# EasyEDA schematic seedrum_shield_v1.json

## Sheets
1 Main Shield: TITLE: Seedup Processors; REV: 1.0; Date: 2020-10-29; Sheet: 1/1; Drawn By: victor.halla; Company: Seedup
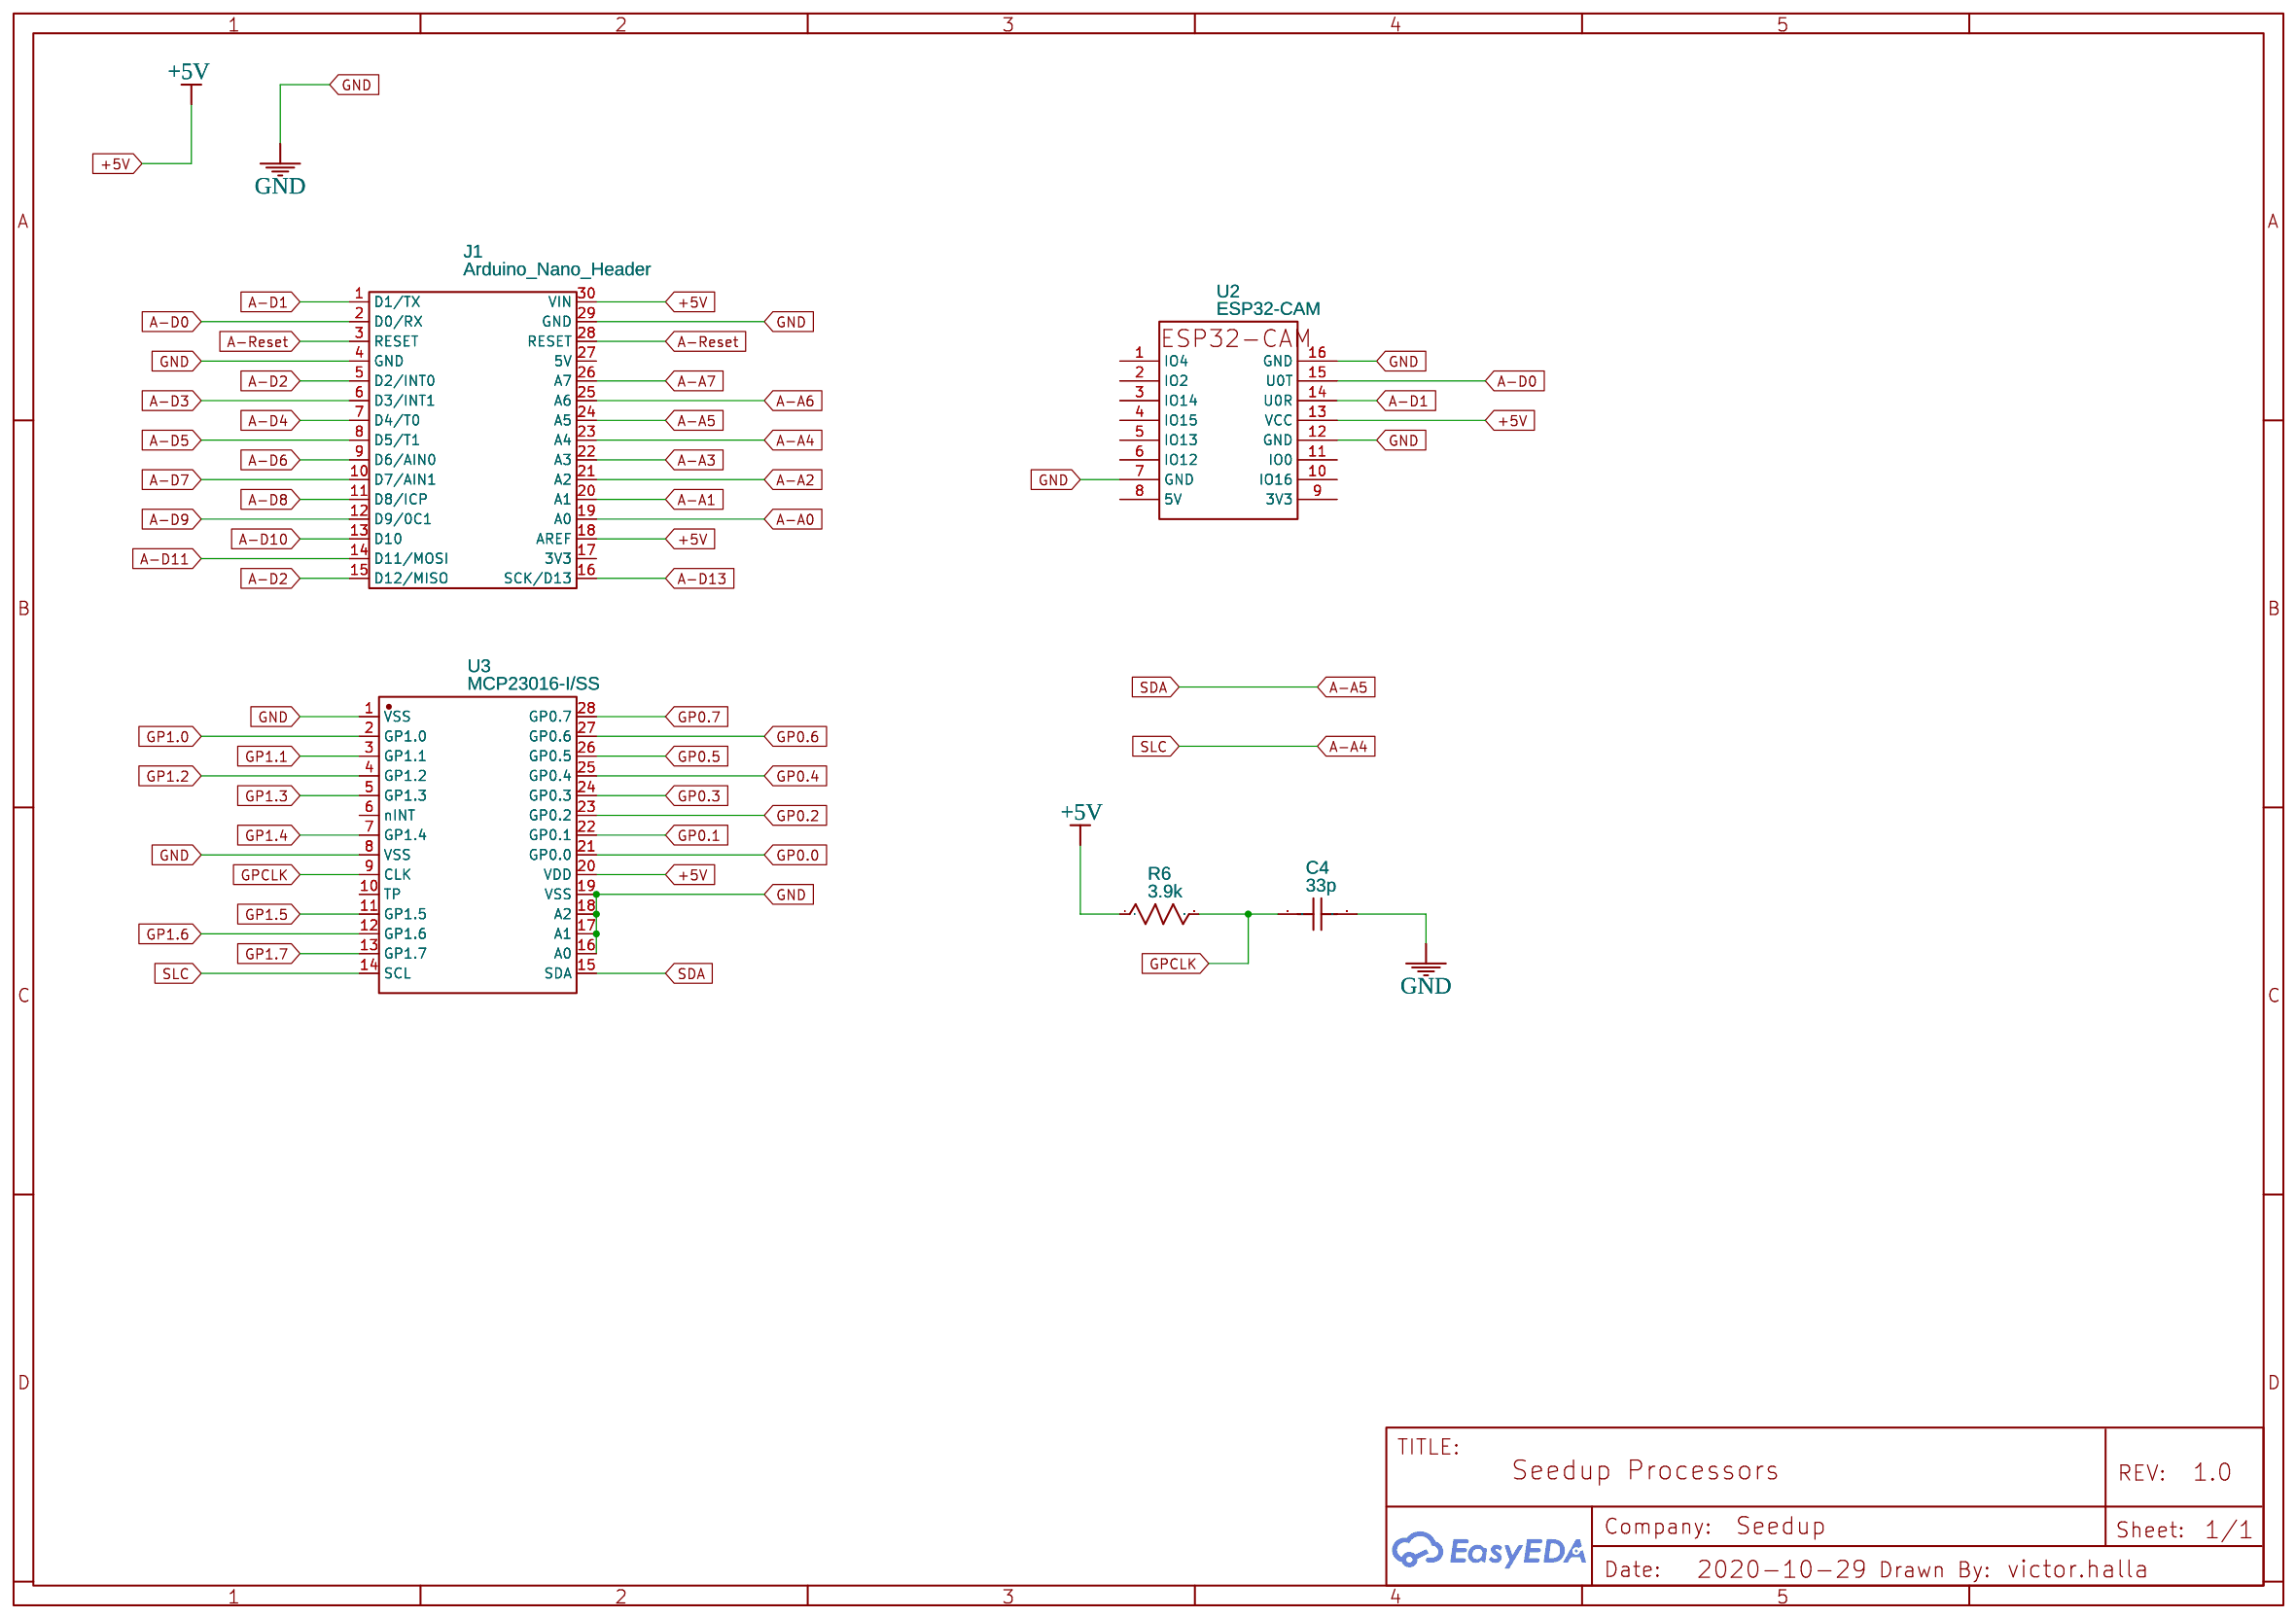
[diagram p0: Main Shield]
2 Power: TITLE: Seedup Power; Date: 2020-10-30
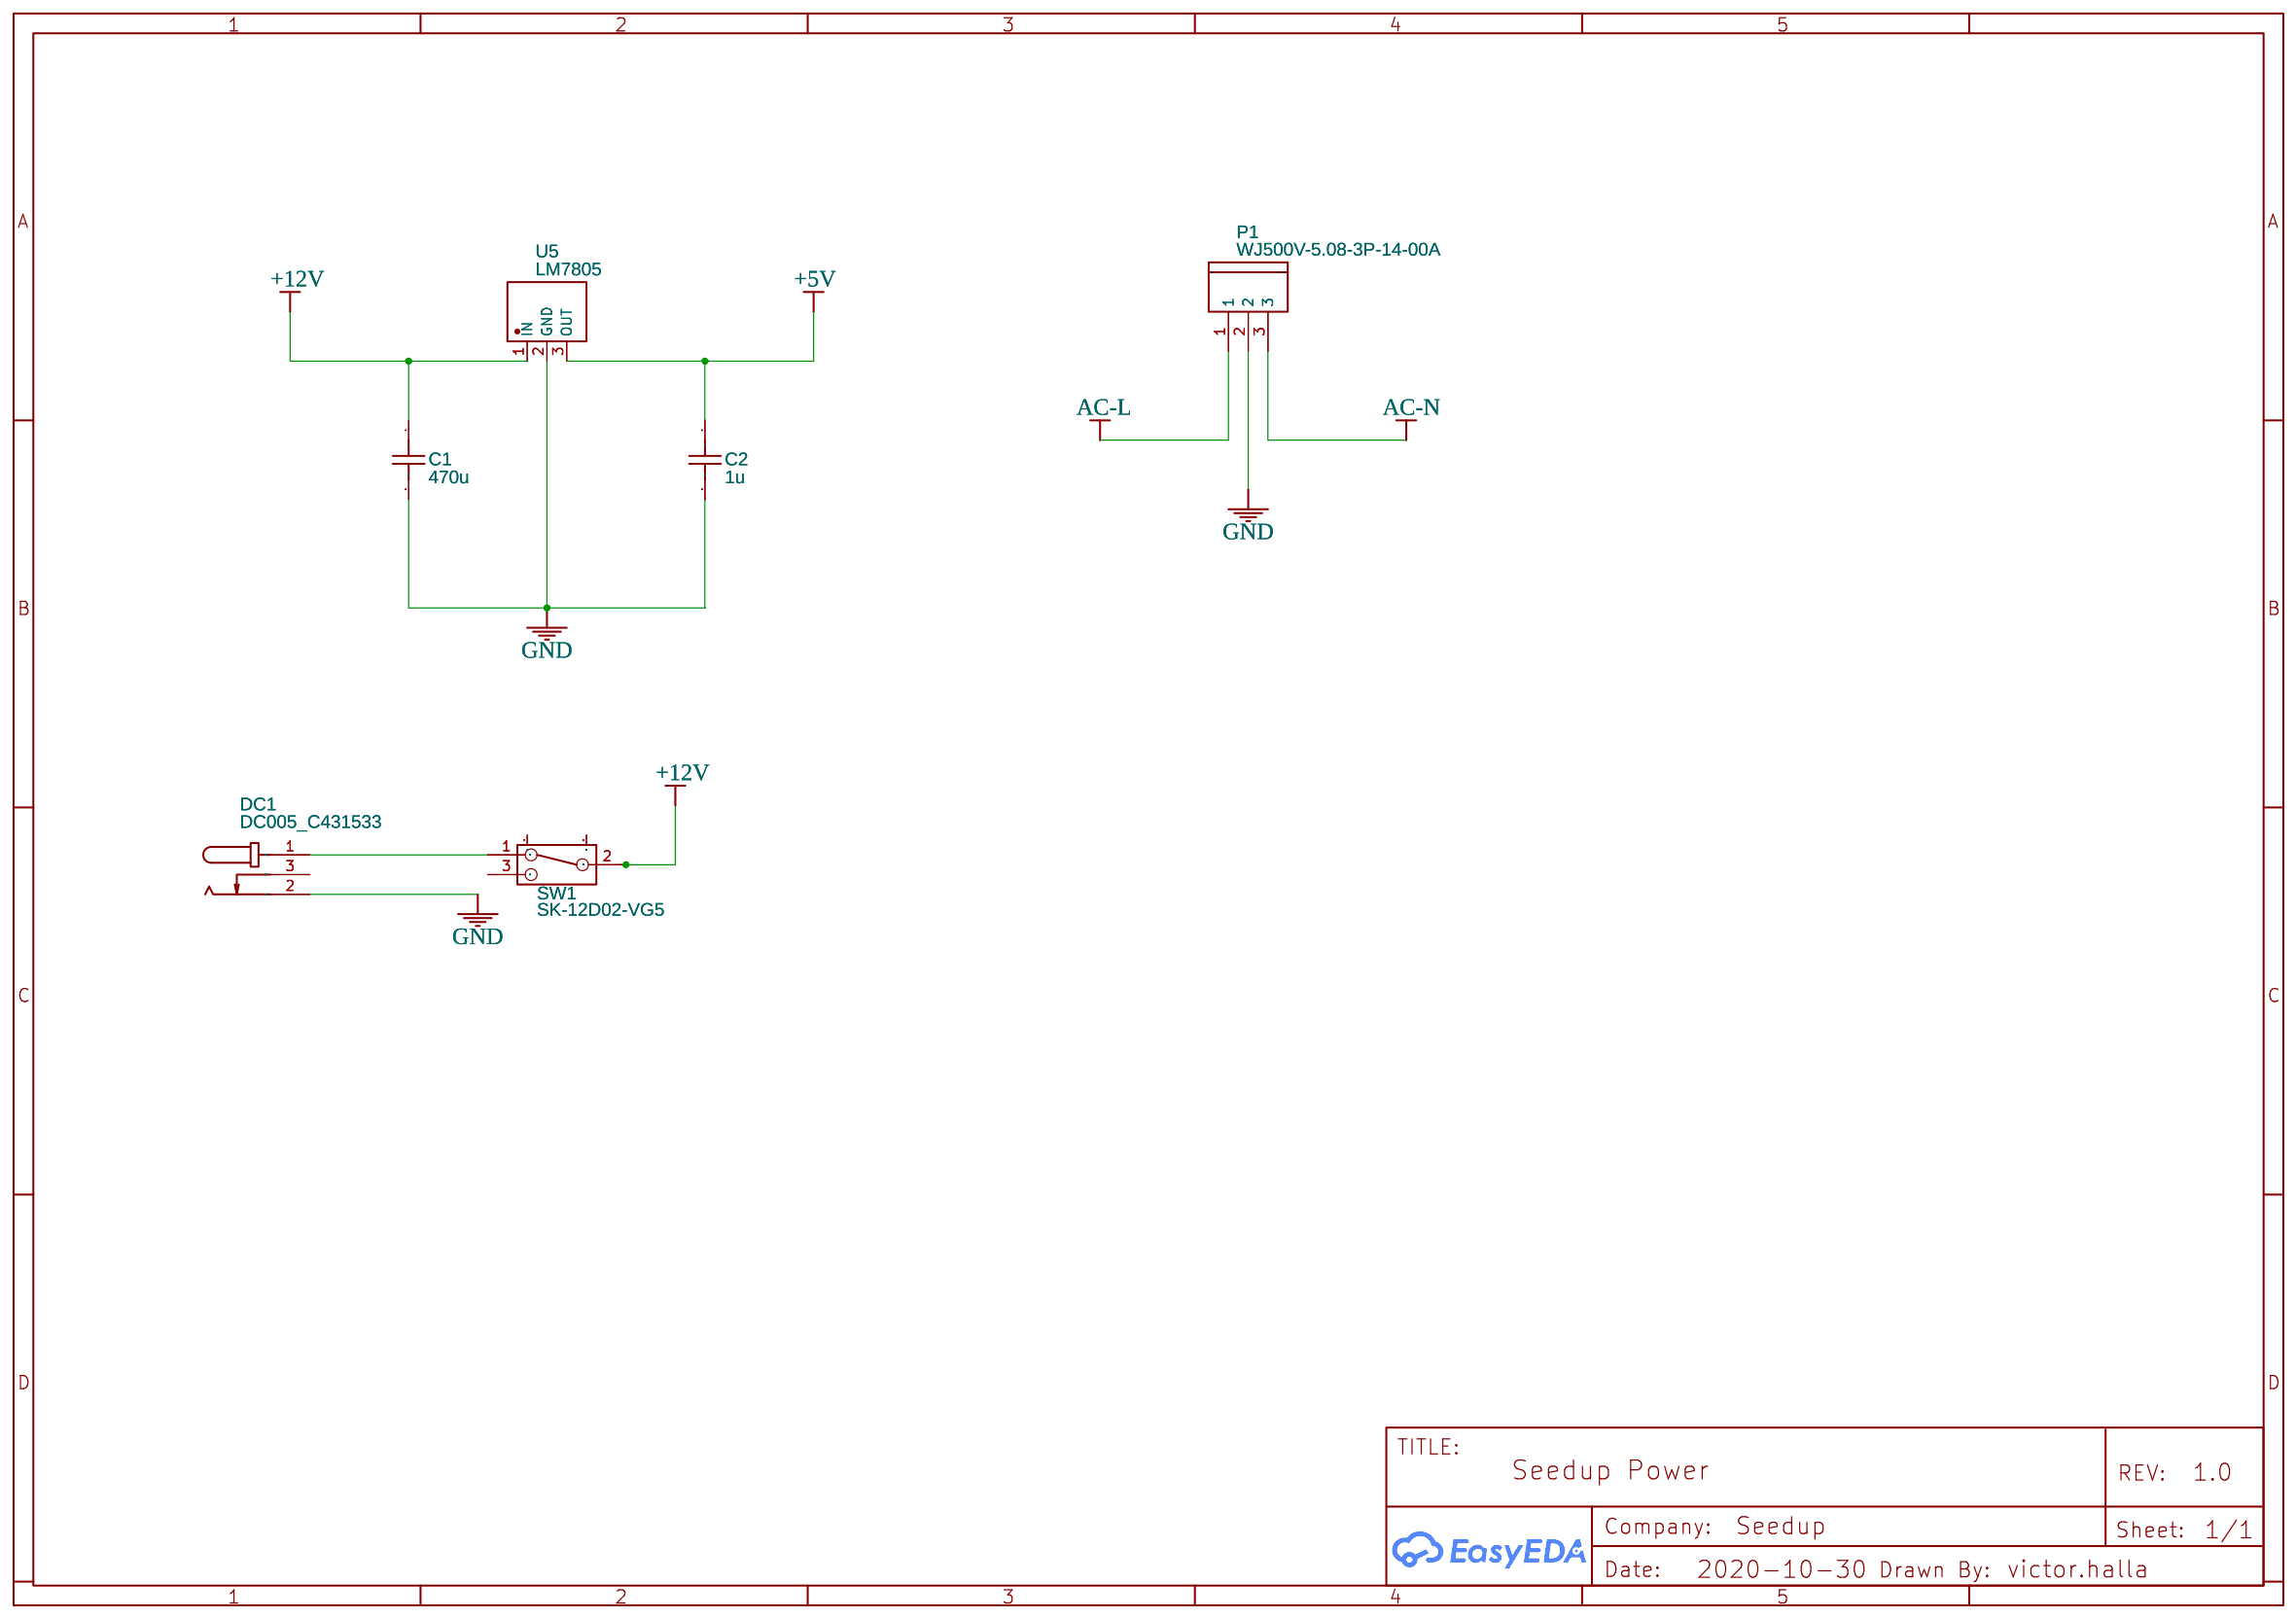
[diagram p1: Power]
3 Sensors: TITLE: Sensors; Date: 2020-10-30
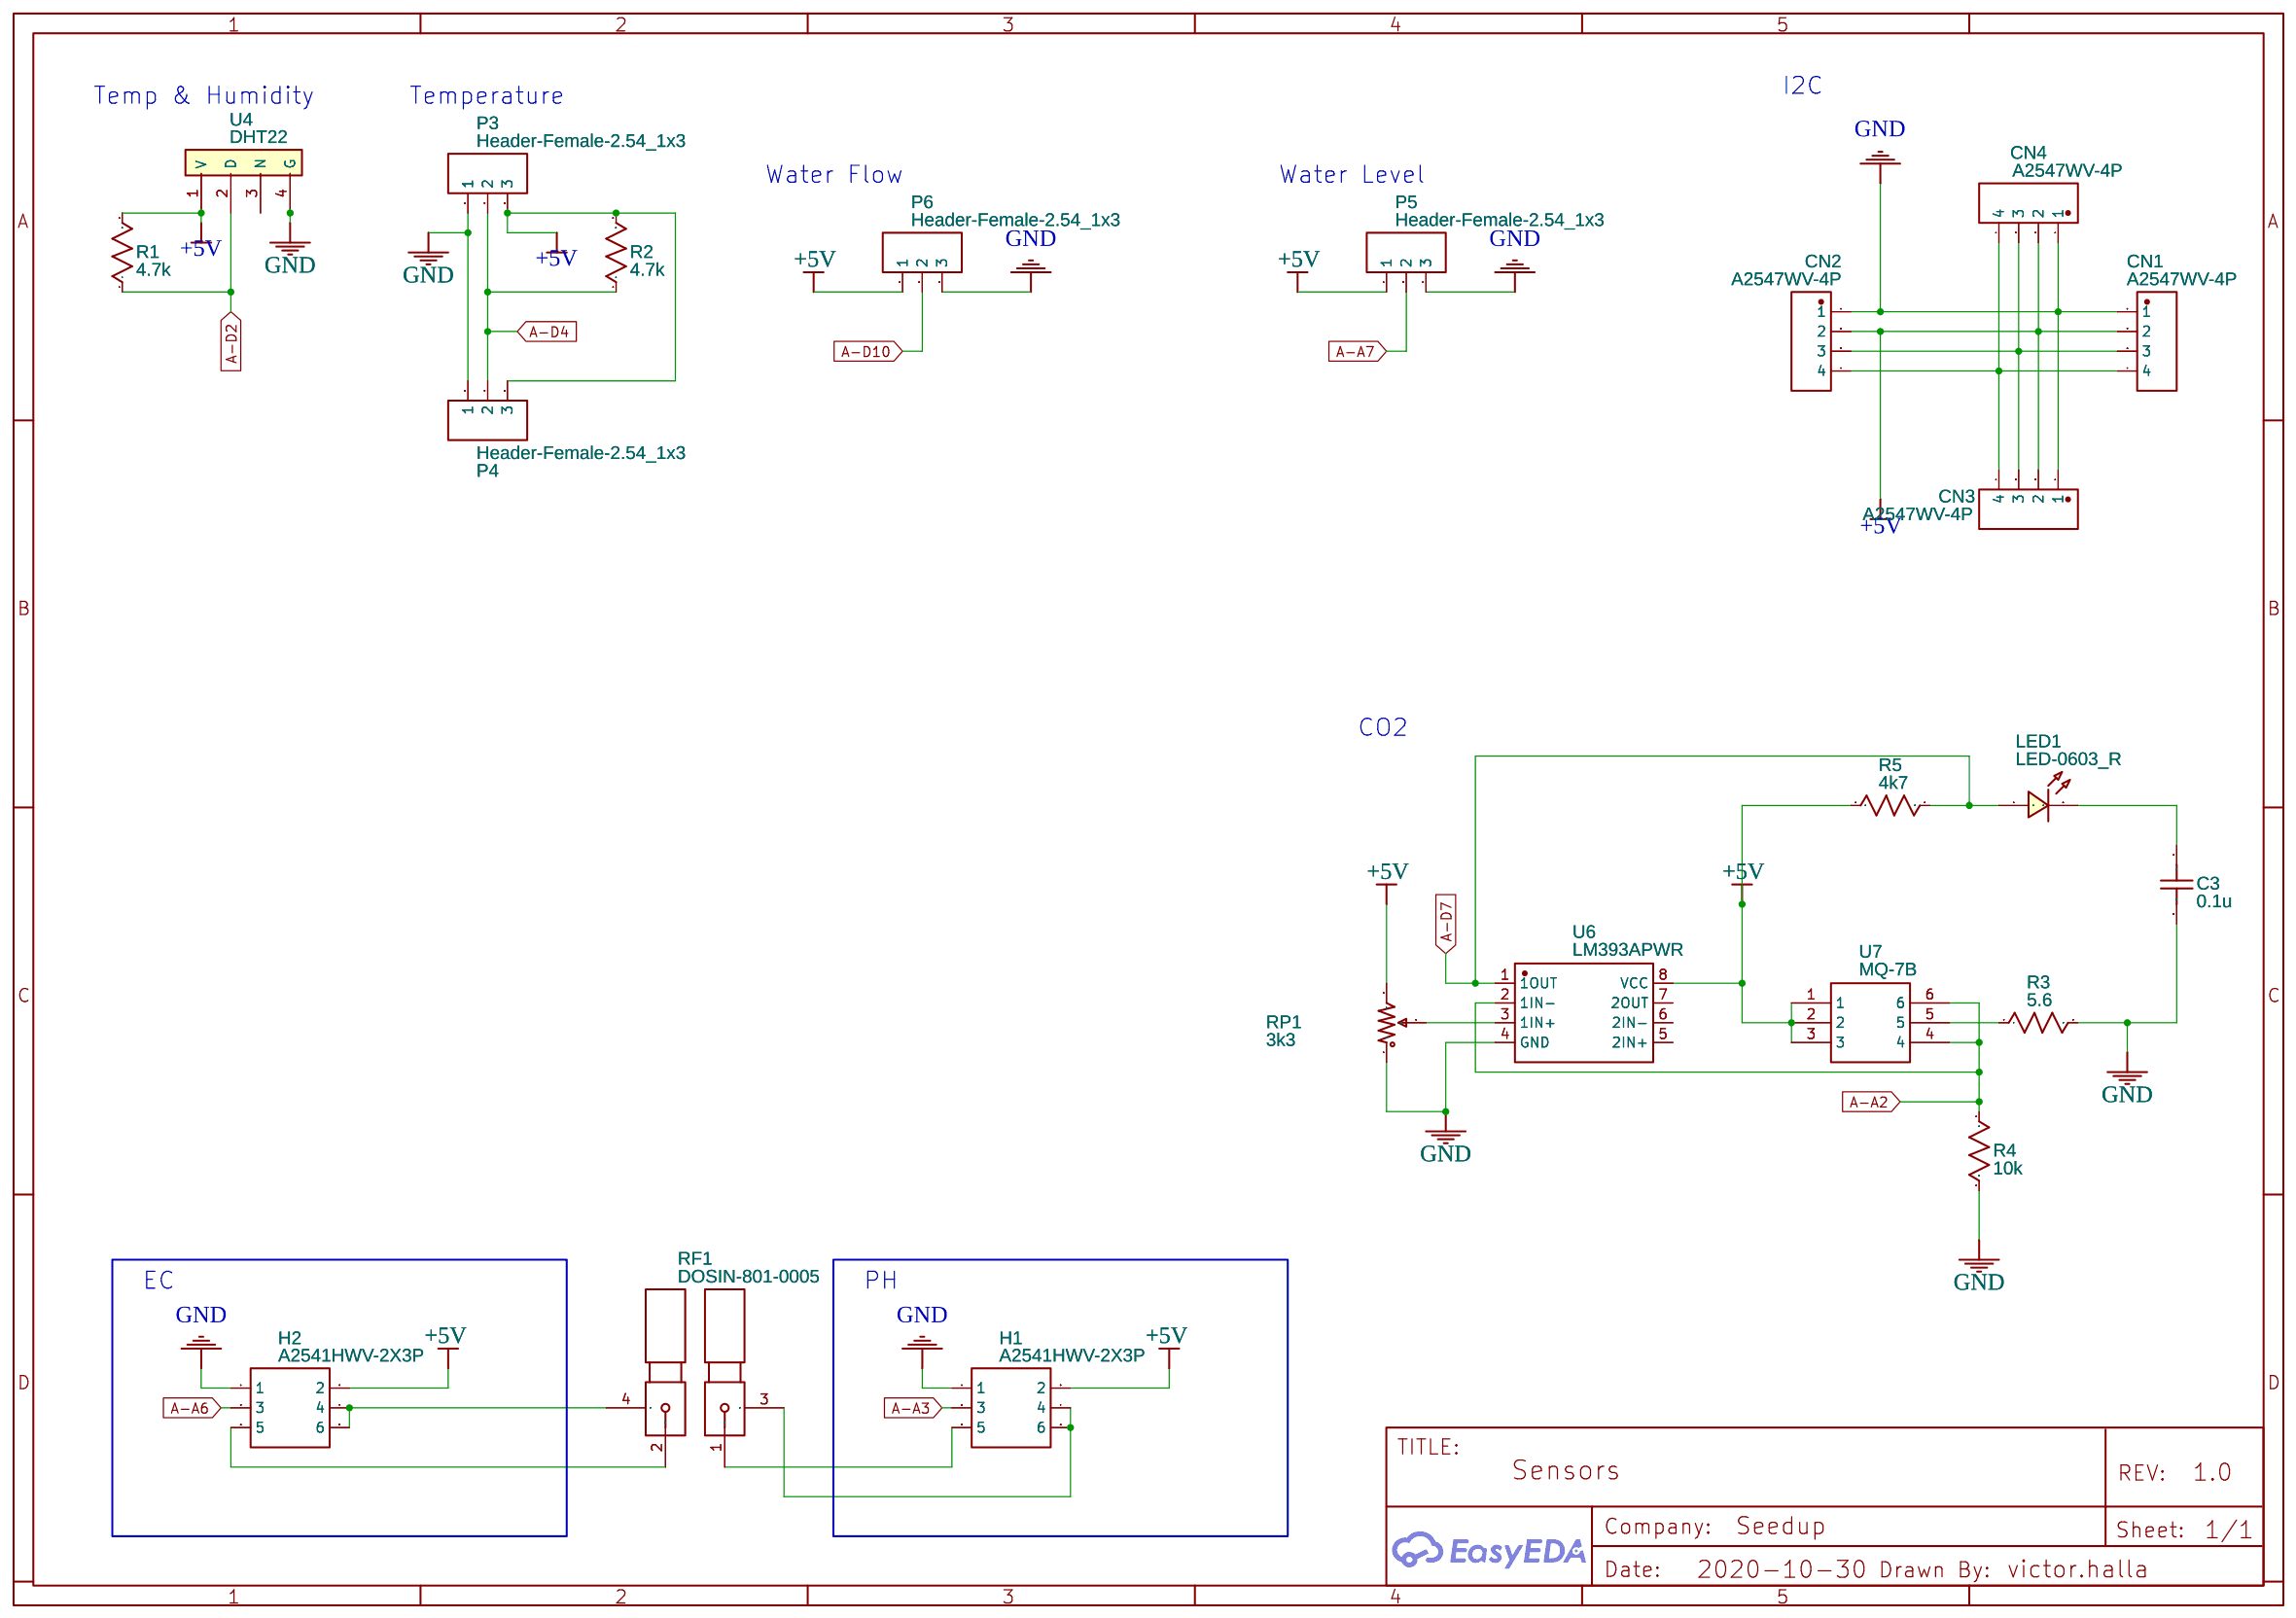
[diagram p2: Sensors]
4 Relay: TITLE: Relay; Date: 2020-10-30
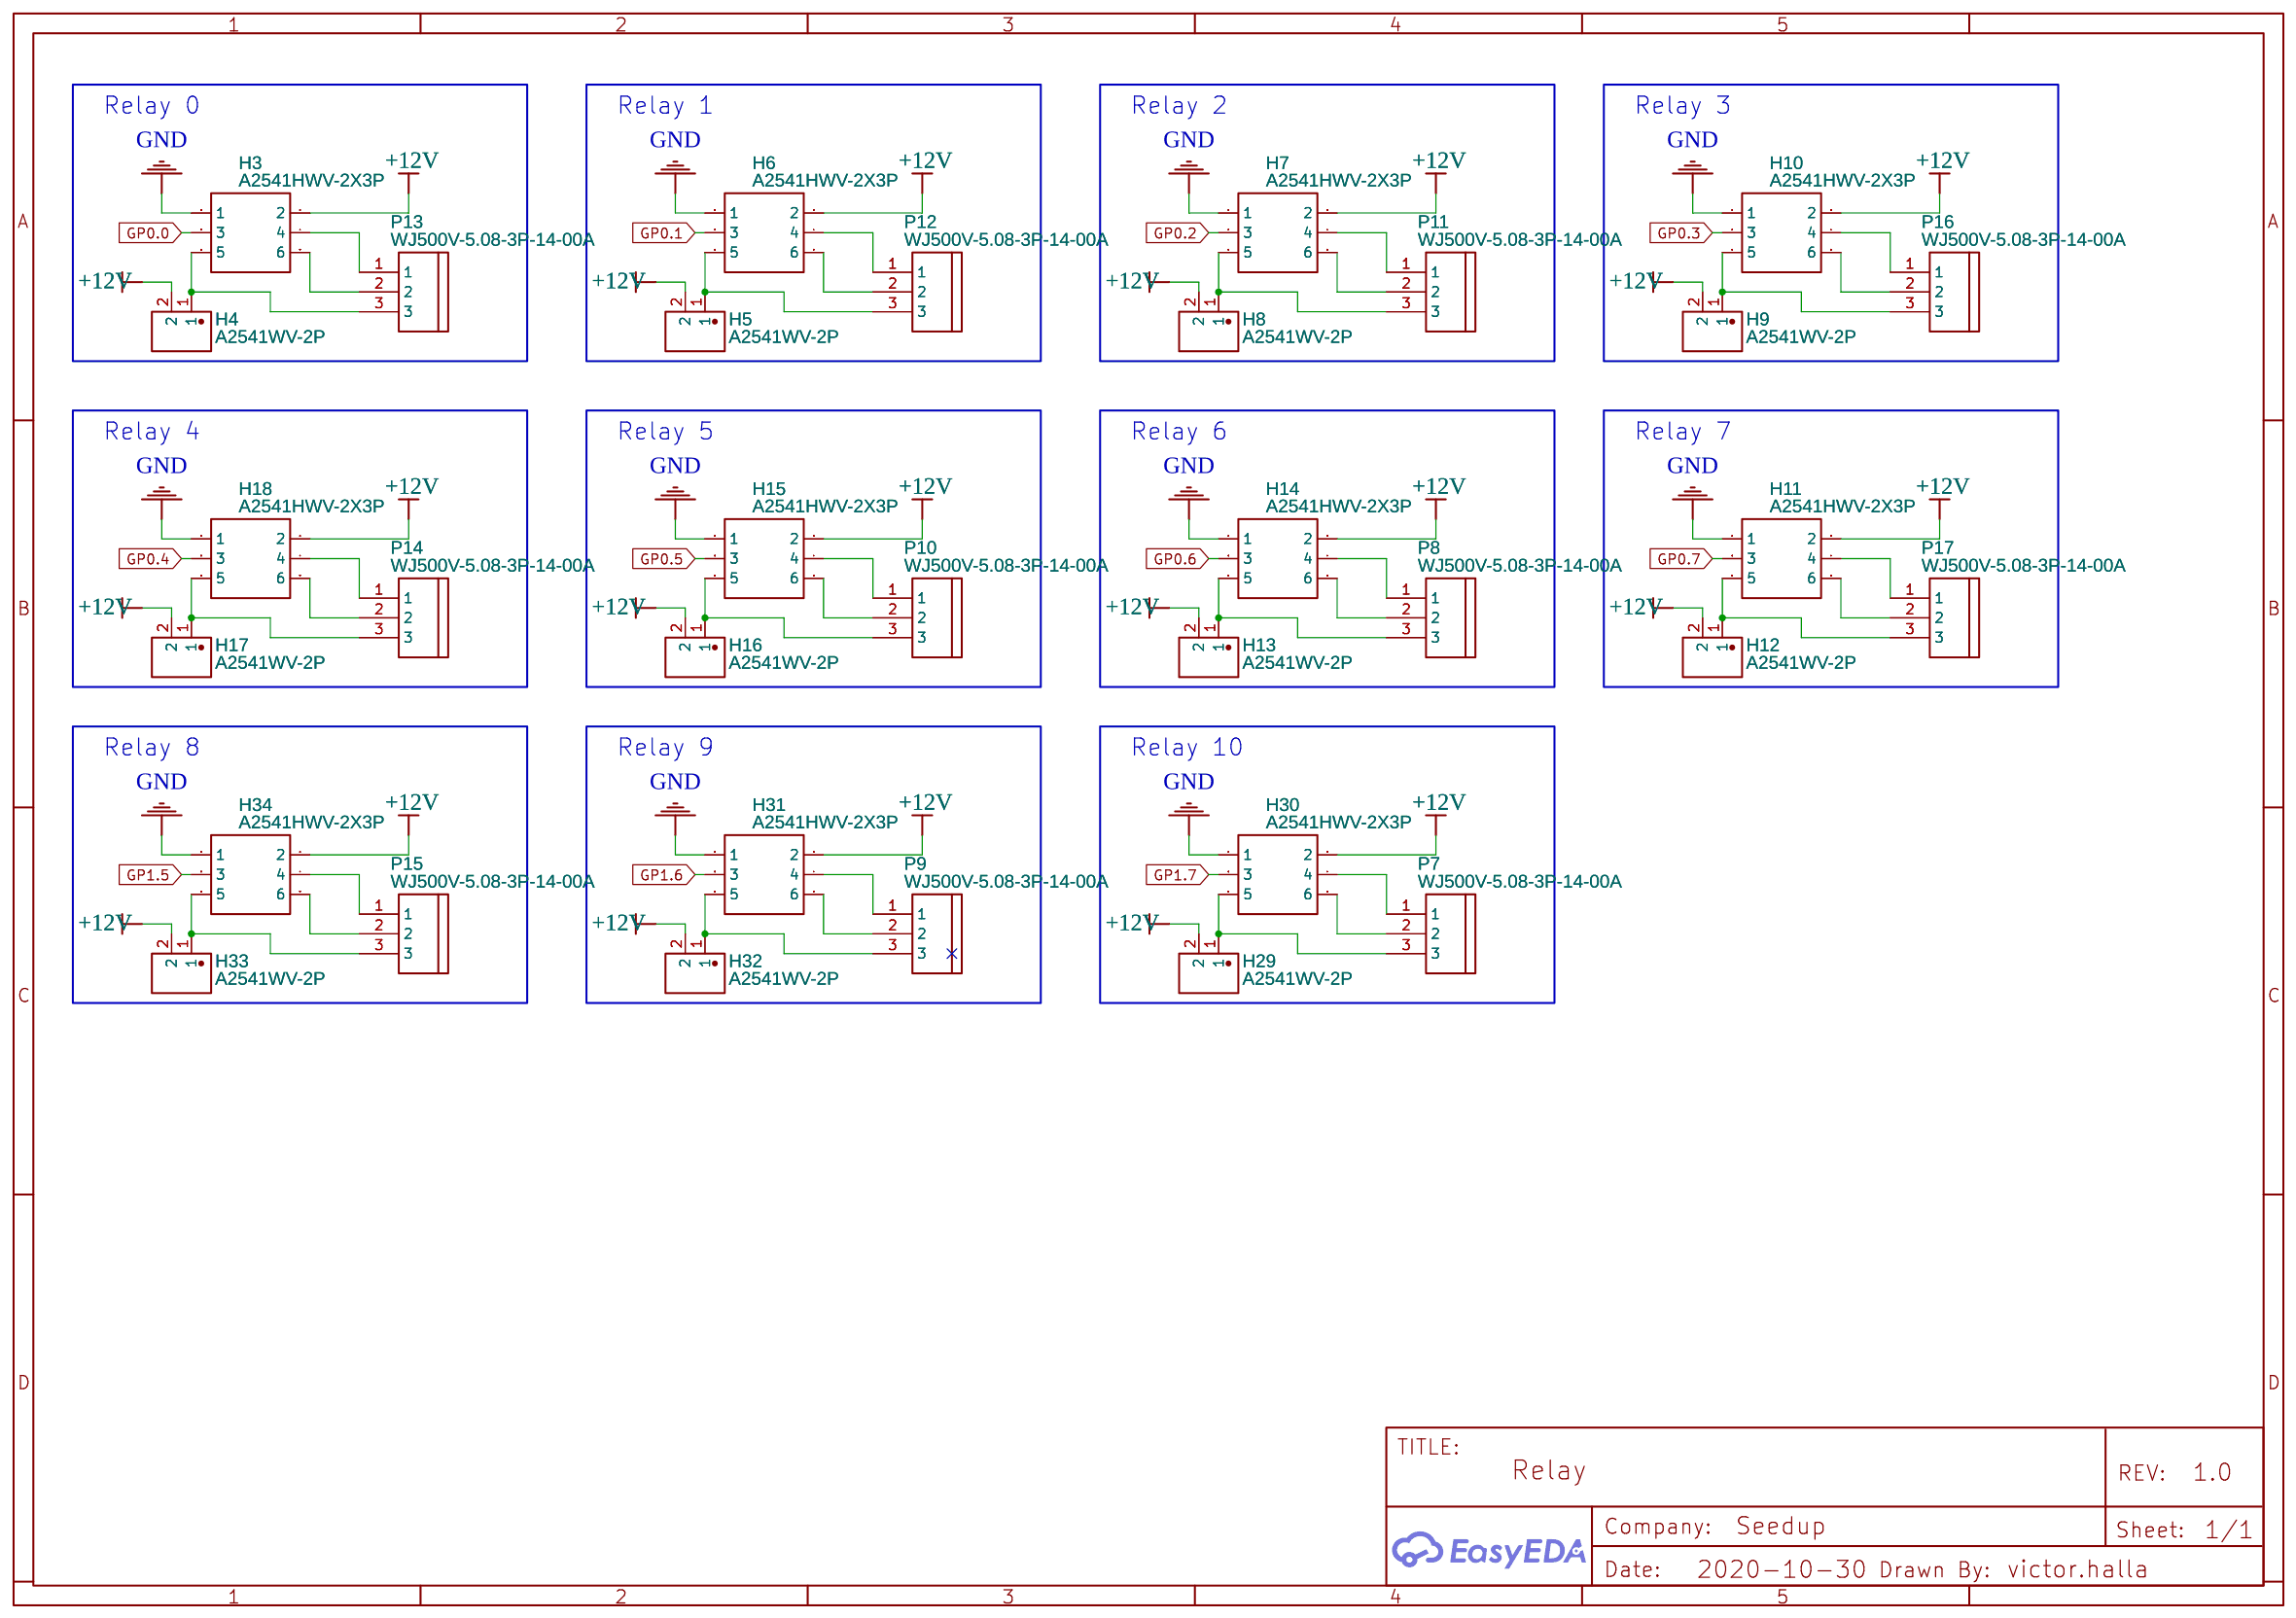
[diagram p3: Relay]
5 Transistor: TITLE: Transistors; Date: 2020-10-30
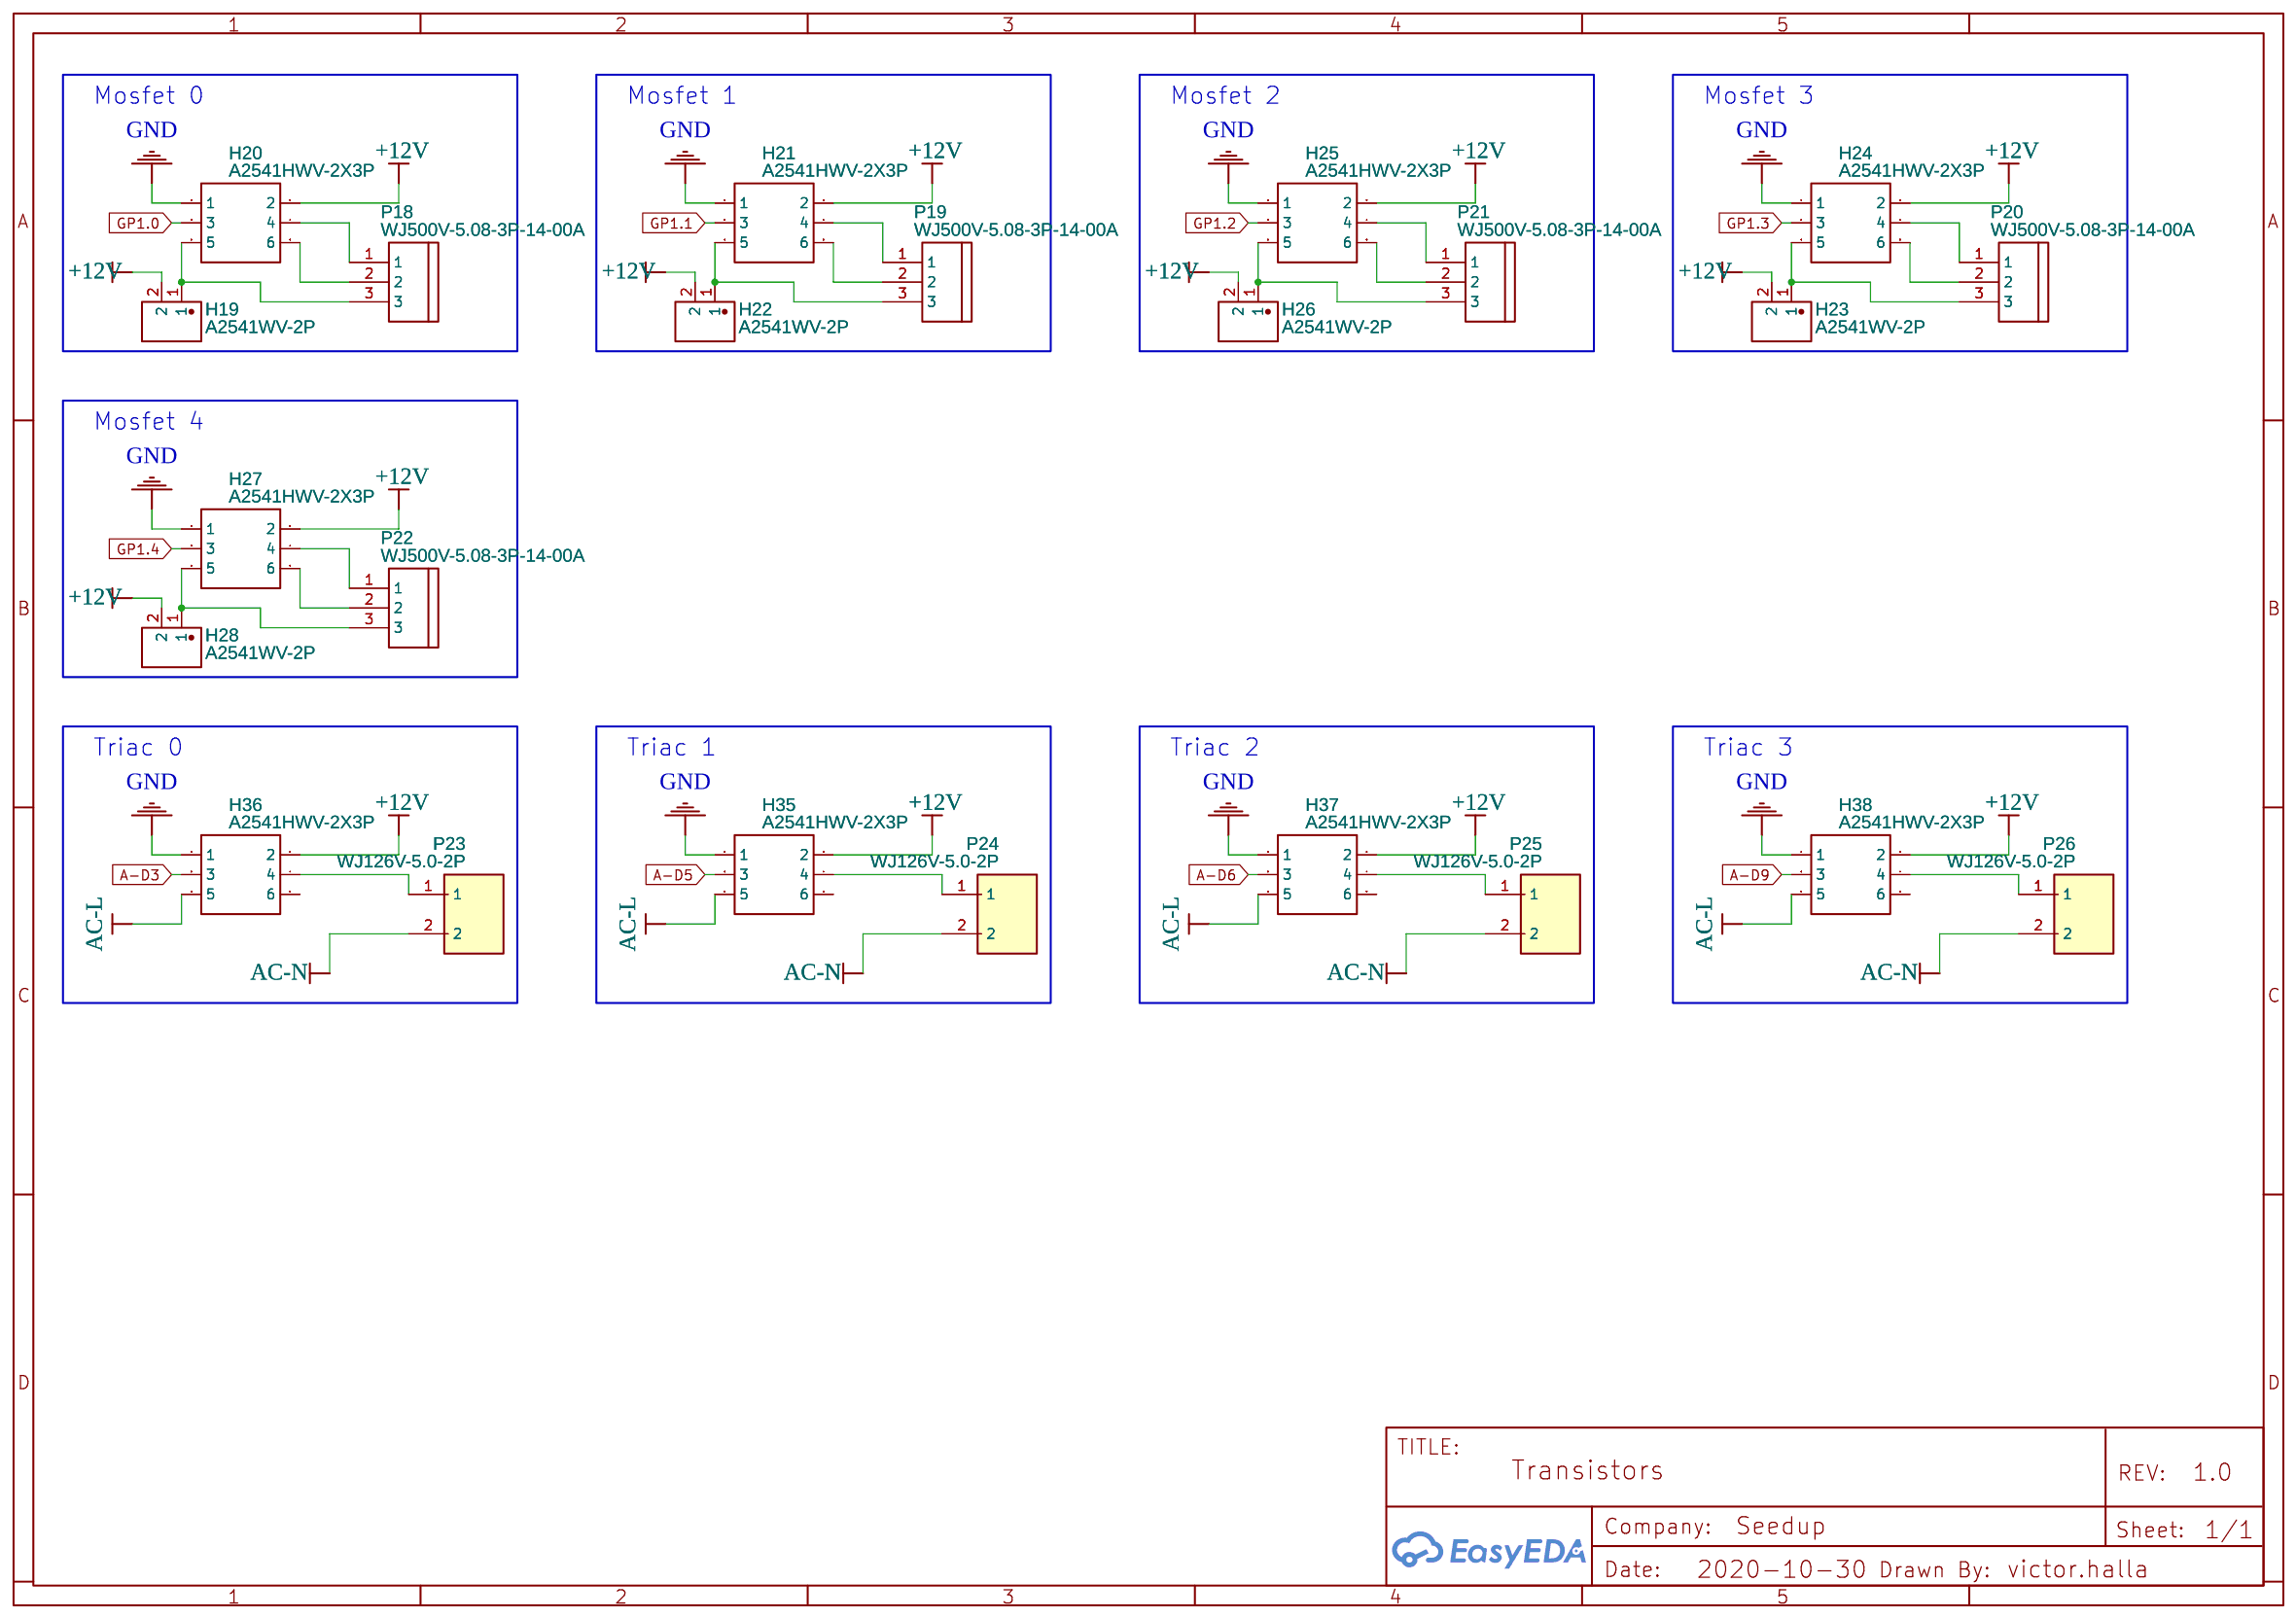
[diagram p4: Transistor]

## Parts
sheet Main Shield
C4  33p  [C0603]
J1  Arduino_Nano_Header  [DIP-30_L43.18-W15.24-ARDUINONANO]
R6  3.9k  [R0603]
U2  ESP32-CAM  [ESP32-CAM]
U3  MCP23016-I/SS  [TSSOP-28_L9.7-W4.4-P0.65-LS6.4-BL]
sheet Power
C1  470u  [C0603]
C2  1u  [C0603]
DC1  DC005_C431533  [DC-IN-TH_DC005]
P1  WJ500V-5.08-3P-14-00A  [CONN-TH_3P-P5.00_WJ500V-5.08-3P]
SW1  SK-12D02-VG5  [SW-TH_SK-12D02VG3]
U5  LM7805  [TO-220-3_L10.0-W4.5-P2.54-L]
sheet Relay
H3  A2541HWV-2X3P  [HDR-TH_6P-P2.54-V-R2-C3-S2.54_A2541WV-2X3P]
H4  A2541WV-2P  [HDR-TH_P2.54-H-M_A2541WV-2P]
H5  A2541WV-2P  [HDR-TH_P2.54-H-M_A2541WV-2P]
H6  A2541HWV-2X3P  [HDR-TH_6P-P2.54-V-R2-C3-S2.54_A2541WV-2X3P]
H7  A2541HWV-2X3P  [HDR-TH_6P-P2.54-V-R2-C3-S2.54_A2541WV-2X3P]
H8  A2541WV-2P  [HDR-TH_P2.54-H-M_A2541WV-2P]
H9  A2541WV-2P  [HDR-TH_P2.54-H-M_A2541WV-2P]
H10  A2541HWV-2X3P  [HDR-TH_6P-P2.54-V-R2-C3-S2.54_A2541WV-2X3P]
H11  A2541HWV-2X3P  [HDR-TH_6P-P2.54-V-R2-C3-S2.54_A2541WV-2X3P]
H12  A2541WV-2P  [HDR-TH_P2.54-H-M_A2541WV-2P]
H13  A2541WV-2P  [HDR-TH_P2.54-H-M_A2541WV-2P]
H14  A2541HWV-2X3P  [HDR-TH_6P-P2.54-V-R2-C3-S2.54_A2541WV-2X3P]
H15  A2541HWV-2X3P  [HDR-TH_6P-P2.54-V-R2-C3-S2.54_A2541WV-2X3P]
H16  A2541WV-2P  [HDR-TH_P2.54-H-M_A2541WV-2P]
H17  A2541WV-2P  [HDR-TH_P2.54-H-M_A2541WV-2P]
H18  A2541HWV-2X3P  [HDR-TH_6P-P2.54-V-R2-C3-S2.54_A2541WV-2X3P]
H29  A2541WV-2P  [HDR-TH_P2.54-H-M_A2541WV-2P]
H30  A2541HWV-2X3P  [HDR-TH_6P-P2.54-V-R2-C3-S2.54_A2541WV-2X3P]
H31  A2541HWV-2X3P  [HDR-TH_6P-P2.54-V-R2-C3-S2.54_A2541WV-2X3P]
H32  A2541WV-2P  [HDR-TH_P2.54-H-M_A2541WV-2P]
H33  A2541WV-2P  [HDR-TH_P2.54-H-M_A2541WV-2P]
H34  A2541HWV-2X3P  [HDR-TH_6P-P2.54-V-R2-C3-S2.54_A2541WV-2X3P]
P7  WJ500V-5.08-3P-14-00A  [CONN-TH_3P-P5.00_WJ500V-5.08-3P]
P8  WJ500V-5.08-3P-14-00A  [CONN-TH_3P-P5.00_WJ500V-5.08-3P]
P9  WJ500V-5.08-3P-14-00A  [CONN-TH_3P-P5.00_WJ500V-5.08-3P]
P10  WJ500V-5.08-3P-14-00A  [CONN-TH_3P-P5.00_WJ500V-5.08-3P]
P11  WJ500V-5.08-3P-14-00A  [CONN-TH_3P-P5.00_WJ500V-5.08-3P]
P12  WJ500V-5.08-3P-14-00A  [CONN-TH_3P-P5.00_WJ500V-5.08-3P]
P13  WJ500V-5.08-3P-14-00A  [CONN-TH_3P-P5.00_WJ500V-5.08-3P]
P14  WJ500V-5.08-3P-14-00A  [CONN-TH_3P-P5.00_WJ500V-5.08-3P]
P15  WJ500V-5.08-3P-14-00A  [CONN-TH_3P-P5.00_WJ500V-5.08-3P]
P16  WJ500V-5.08-3P-14-00A  [CONN-TH_3P-P5.00_WJ500V-5.08-3P]
P17  WJ500V-5.08-3P-14-00A  [CONN-TH_3P-P5.00_WJ500V-5.08-3P]
sheet Sensors
C3  0.1u  [C0603]
CN1  A2547WV-4P  [CONN-TH_A2547WV-4P]
CN2  A2547WV-4P  [CONN-TH_A2547WV-4P]
CN3  A2547WV-4P  [CONN-TH_A2547WV-4P]
CN4  A2547WV-4P  [CONN-TH_A2547WV-4P]
H1  A2541HWV-2X3P  [HDR-TH_6P-P2.54-V-R2-C3-S2.54_A2541WV-2X3P]
H2  A2541HWV-2X3P  [HDR-TH_6P-P2.54-V-R2-C3-S2.54_A2541WV-2X3P]
LED1  LED-0603_R  [LED0603_RED]
P3  Header-Female-2.54_1x3  [HDR-TH_3P-P2.54-V]
P4  Header-Female-2.54_1x3  [HDR-TH_3P-P2.54-V]
P5  Header-Female-2.54_1x3  [HDR-TH_3P-P2.54-V]
P6  Header-Female-2.54_1x3  [HDR-TH_3P-P2.54-V]
R1  4.7k  [R0603]
R2  4.7k  [R0603]
R3  5.6  [R0603]
R4  10k  [R0603]
R5  4k7  [R0603]
RF1  DOSIN-801-0005  [BNC-TH_DOSIN-801-0005]
RP1  3k3  [RES-ADJ-TH_3386P]
U4  DHT22  [DHT22_AM2303_VERT]
U6  LM393APWR  [TSSOP-8_L4.4-W3.0-P0.65-LS6.4-BL]
U7  MQ-7B  [SENSOR-TH_MQ-9B]
sheet Transistor
H19  A2541WV-2P  [HDR-TH_P2.54-H-M_A2541WV-2P]
H20  A2541HWV-2X3P  [HDR-TH_6P-P2.54-V-R2-C3-S2.54_A2541WV-2X3P]
H21  A2541HWV-2X3P  [HDR-TH_6P-P2.54-V-R2-C3-S2.54_A2541WV-2X3P]
H22  A2541WV-2P  [HDR-TH_P2.54-H-M_A2541WV-2P]
H23  A2541WV-2P  [HDR-TH_P2.54-H-M_A2541WV-2P]
H24  A2541HWV-2X3P  [HDR-TH_6P-P2.54-V-R2-C3-S2.54_A2541WV-2X3P]
H25  A2541HWV-2X3P  [HDR-TH_6P-P2.54-V-R2-C3-S2.54_A2541WV-2X3P]
H26  A2541WV-2P  [HDR-TH_P2.54-H-M_A2541WV-2P]
H27  A2541HWV-2X3P  [HDR-TH_6P-P2.54-V-R2-C3-S2.54_A2541WV-2X3P]
H28  A2541WV-2P  [HDR-TH_P2.54-H-M_A2541WV-2P]
H35  A2541HWV-2X3P  [HDR-TH_6P-P2.54-V-R2-C3-S2.54_A2541WV-2X3P]
H36  A2541HWV-2X3P  [HDR-TH_6P-P2.54-V-R2-C3-S2.54_A2541WV-2X3P]
H37  A2541HWV-2X3P  [HDR-TH_6P-P2.54-V-R2-C3-S2.54_A2541WV-2X3P]
H38  A2541HWV-2X3P  [HDR-TH_6P-P2.54-V-R2-C3-S2.54_A2541WV-2X3P]
P18  WJ500V-5.08-3P-14-00A  [CONN-TH_3P-P5.00_WJ500V-5.08-3P]
P19  WJ500V-5.08-3P-14-00A  [CONN-TH_3P-P5.00_WJ500V-5.08-3P]
P20  WJ500V-5.08-3P-14-00A  [CONN-TH_3P-P5.00_WJ500V-5.08-3P]
P21  WJ500V-5.08-3P-14-00A  [CONN-TH_3P-P5.00_WJ500V-5.08-3P]
P22  WJ500V-5.08-3P-14-00A  [CONN-TH_3P-P5.00_WJ500V-5.08-3P]
P23  WJ126V-5.0-2P  [CONN-TH_WJ126V-5.0-2P]
P24  WJ126V-5.0-2P  [CONN-TH_WJ126V-5.0-2P]
P25  WJ126V-5.0-2P  [CONN-TH_WJ126V-5.0-2P]
P26  WJ126V-5.0-2P  [CONN-TH_WJ126V-5.0-2P]

## Library data of the parts
C1-C4 = C_0603_US: Contributor: LCEDA_Lib
J1 = Arduino_Nano_Header
R1-R6 = R_0603_US: Contributor: LCEDA_Lib
U2 = ESP32-CAM: Contributor: MiniMax
U3 = MCP23016-I/SS: Supplier: LCSC; Supplier Part: C184175; Manufacturer: Microchip Tech; Contributor: LCSC; LCSC Assembly: Yes; SMT Type: Extend
DC1 = DC005_C431533: Supplier: LCSC; Supplier Part: C431533; Manufacturer: SHOU HAN; Manufacturer Part: DC005; Contributor: LCSC
P1 P7-P22 = WJ500V-5.08-3P-14-00A: Supplier: LCSC; Manufacturer: ReliaPro; image: //image.lceda.cn/szlcsc/C72334.jpg; Supplier Part: C72334
SW1 = SK-12D02-VG5: Supplier: LCSC; Supplier Part: C136722; Manufacturer: Rectangular Connectors - Contacts; Contributor: LCSC
U5 = LM7805: Supplier: LCSC; Supplier Part: C845394; Manufacturer: TF; Contributor: LCSC
H1-H3 H6 H7 H10 H11 H14 H15 H18 H20 H21 H24 H25 H27 H30 H31 H34-H38 = A2541HWV-2X3P: Supplier: LCSC; Supplier Part: C239343; Manufacturer: Changjiang Connectors; Manufacturer Part: A2541HWV-2x3P; Contributor: LCSC; link: https://item.szlcsc.com/238447.html?ref=editor&logined=true
H4 H5 H8 H9 H12 H13 H16 H17 H19 H22 H23 H26 H28 H29 H32 H33 = A2541WV-2P: Supplier: LCSC; Supplier Part: C225477; Manufacturer: CJT(Changjiang Connectors); Contributor: LCSC
CN1-CN4 = A2547WV-4P: Supplier: LCSC; Supplier Part: C239379; Manufacturer: Changjiang Connectors; Contributor: LCSC
LED1 = LED-0603_R: Manufacturer: EVERLIGHT(台湾亿光); Manufacturer Part: 19-217/R6C-AL1M2VY/3T; Supplier Part: C72044; Supplier: LCSC; Contributor: LCEDA_01
P3-P6 = Header-Female-2.54_1x3: Supplier Part: C146243; Supplier: LCSC; Manufacturer: Boom Precision Elec; link: https://datasheet.lcsc.com/szlcsc/Boom-Precision-Elec-2-54mm-1-8P-Straight-Female-header_C27438.pdf
RF1 = DOSIN-801-0005: Supplier: LCSC; Supplier Part: C521213; Manufacturer: dosinconn; Contributor: LCSC
RP1 = R_3386P_US: Supplier: LCSC; Contributor: LCEDA_Lib; value(Ω): 10K
U4 = DHT22: Digital-output relative humidity & temperature sensor/module; sourceId: GkiDrp9vf; Supplier Part: PRODUCT ID: 385; Supplier: AdaFruit; Voltage: 3.3V - 5.5V; Mounted: Yes; Manufacturer: Aosong (Guangzhou) Electronics Co., Ltd.
U6 = LM393APWR: Supplier: LCSC; Supplier Part: C527473; Manufacturer: Texas Instruments; Contributor: LCSC; LCSC Assembly: Yes; SMT Type: Extend
U7 = MQ-7B: Supplier: LCSC; Supplier Part: C242495; Manufacturer: Zhengzhou Winsen Elec Tech; Contributor: LCSC
P23-P26 = WJ126V-5.0-2P: Supplier: LCSC; Manufacturer: ReliaPro; image: //image.lceda.cn/szlcsc/C8404.jpg; Supplier Part: C8404

## Nets
+5V: C2.1 CN1.2 CN2.2 CN3.2 CN4.2 H1.2 H2.2 J1.18(AREF) J1.30(VIN) P3.3 P4.3 P5.1 P6.1 R1.2 R2.2 R5.1 R6.1 RP1.3 U2.13(VCC) U3.20(VDD) U4.1(V) U5.3(OUT) U6.8(VCC) U7.1 U7.2 U7.3
+12V: C1.1 H3.2 H4.2 H5.2 H6.2 H7.2 H8.2 H9.2 H10.2 H11.2 H12.2 H13.2 H14.2 H15.2 H16.2 H17.2 H18.2 H19.2 H20.2 H21.2 H22.2 H23.2 H24.2 H25.2 H26.2 H27.2 H28.2 H29.2 H30.2 H31.2 H32.2 H33.2 H34.2 H35.2 H36.2 H37.2 H38.2 SW1.2 U5.1(IN)
GND: C1.2 C2.2 C3.2 C4.2 CN1.1 CN2.1 CN3.1 CN4.1 DC1.2 H1.1 H2.1 H3.1 H6.1 H7.1 H10.1 H11.1 H14.1 H15.1 H18.1 H20.1 H21.1 H24.1 H25.1 H27.1 H30.1 H31.1 H34.1 H35.1 H36.1 H37.1 H38.1 J1.4(GND) J1.29(GND) P1.2 P3.1 P4.1 P5.3 P6.3 R3.2 R4.2 RP1.1 U2.7(GND) U2.12(GND) U2.16(GND) U3.1(VSS) U3.8(VSS) U3.16(A0) U3.17(A1) U3.18(A2) U3.19(VSS) U4.4(G) U5.2(GND) U6.4(GND)
A-A0: J1.19(A0)
A-A1: J1.20(A1)
A-A2: J1.21(A2) R4.1 U6.2(1IN−) U7.4 U7.6
A-A3: H1.3 J1.22(A3)
A-A4: J1.23(A4) U3.14(SCL)
A-A5: J1.24(A5) U3.15(SDA)
A-A6: H2.3 J1.25(A6)
A-A7: J1.26(A7) P5.2
A-D0: J1.2(D0/RX) U2.15(U0T)
A-D1: J1.1(D1/TX) U2.14(U0R)
A-D2: J1.5(D2/INT0) J1.15(D12/MISO) R1.1 U4.2(D)
A-D3: H36.3 J1.6(D3/INT1)
A-D4: J1.7(D4/T0) P3.2 P4.2 R2.1
A-D5: H35.3 J1.8(D5/T1)
A-D6: H37.3 J1.9(D6/AIN0)
A-D7: J1.10(D7/AIN1) LED1.1 R5.2 U6.1(1OUT)
A-D8: J1.11(D8/ICP)
A-D9: H38.3 J1.12(D9/0C1)
A-D10: J1.13(D10) P6.2
A-D11: J1.14(D11/MOSI)
A-D13: J1.16(SCK/D13)
A-Reset: J1.3(RESET) J1.28(RESET)
AC-L: H35.5 H36.5 H37.5 H38.5 P1.1
AC-N: P1.3 P23.2 P24.2 P25.2 P26.2
GP0.0: H3.3 U3.21(GP0.0)
GP0.1: H6.3 U3.22(GP0.1)
GP0.2: H7.3 U3.23(GP0.2)
GP0.3: H10.3 U3.24(GP0.3)
GP0.4: H18.3 U3.25(GP0.4)
GP0.5: H15.3 U3.26(GP0.5)
GP0.6: H14.3 U3.27(GP0.6)
GP0.7: H11.3 U3.28(GP0.7)
GP1.0: H20.3 U3.2(GP1.0)
GP1.1: H21.3 U3.3(GP1.1)
GP1.2: H25.3 U3.4(GP1.2)
GP1.3: H24.3 U3.5(GP1.3)
GP1.4: H27.3 U3.7(GP1.4)
GP1.5: H34.3 U3.11(GP1.5)
GP1.6: H31.3 U3.12(GP1.6)
GP1.7: H30.3 U3.13(GP1.7)
GPCLK: C4.1 R6.2 U3.9(CLK)
Net-(C3-1): C3.1 LED1.2
Net-(CN1-3): CN1.3 CN2.3 CN3.3 CN4.3
Net-(CN1-4): CN1.4 CN2.4 CN3.4 CN4.4
Net-(DC1-1): DC1.1 SW1.1
Net-(H1-4): H1.4 H1.6 RF1.3
Net-(H1-5): H1.5 RF1.1
Net-(H2-4): H2.4 H2.6 RF1.4
Net-(H2-5): H2.5 RF1.2
Net-(H3-4): H3.4 P13.1
Net-(H3-5): H3.5 H4.1 P13.3
Net-(H3-6): H3.6 P13.2
Net-(H5-1): H5.1 H6.5 P12.3
Net-(H6-4): H6.4 P12.1
Net-(H6-6): H6.6 P12.2
Net-(H7-4): H7.4 P11.1
Net-(H7-5): H7.5 H8.1 P11.3
Net-(H7-6): H7.6 P11.2
Net-(H9-1): H9.1 H10.5 P16.3
Net-(H10-4): H10.4 P16.1
Net-(H10-6): H10.6 P16.2
Net-(H11-4): H11.4 P17.1
Net-(H11-5): H11.5 H12.1 P17.3
Net-(H11-6): H11.6 P17.2
Net-(H13-1): H13.1 H14.5 P8.3
Net-(H14-4): H14.4 P8.1
Net-(H14-6): H14.6 P8.2
Net-(H15-4): H15.4 P10.1
Net-(H15-5): H15.5 H16.1 P10.3
Net-(H15-6): H15.6 P10.2
Net-(H17-1): H17.1 H18.5 P14.3
Net-(H18-4): H18.4 P14.1
Net-(H18-6): H18.6 P14.2
Net-(H19-1): H19.1 H20.5 P18.3
Net-(H20-4): H20.4 P18.1
Net-(H20-6): H20.6 P18.2
Net-(H21-4): H21.4 P19.1
Net-(H21-5): H21.5 H22.1 P19.3
Net-(H21-6): H21.6 P19.2
Net-(H23-1): H23.1 H24.5 P20.3
Net-(H24-4): H24.4 P20.1
Net-(H24-6): H24.6 P20.2
Net-(H25-4): H25.4 P21.1
Net-(H25-5): H25.5 H26.1 P21.3
Net-(H25-6): H25.6 P21.2
Net-(H27-4): H27.4 P22.1
Net-(H27-5): H27.5 H28.1 P22.3
Net-(H27-6): H27.6 P22.2
Net-(H29-1): H29.1 H30.5 P7.3
Net-(H30-4): H30.4 P7.1
Net-(H30-6): H30.6 P7.2
Net-(H31-4): H31.4 P9.1
Net-(H31-5): H31.5 H32.1 P9.3
Net-(H31-6): H31.6 P9.2
Net-(H33-1): H33.1 H34.5 P15.3
Net-(H34-4): H34.4 P15.1
Net-(H34-6): H34.6 P15.2
Net-(H35-4): H35.4 P24.1
Net-(H36-4): H36.4 P23.1
Net-(H37-4): H37.4 P25.1
Net-(H38-4): H38.4 P26.1
Net-(R3-1): R3.1 U7.5
Net-(RP1-2): RP1.2 U6.3(1IN+)

Not connected (* = marked no-connect by the designer): DC1 3; H35 6; H36 6; H37 6; H38 6; J1 17(3V3) 27(5V); SW1 3 4 5; U2 1(IO4) 2(IO2) 3(IO14) 4(IO15) 5(IO13) 6(IO12) 8(5V) 9(3V3) 10(IO16) 11(IO0); U3 6(nINT) 10(TP); U4 3(N); U6 5(2IN+) 6(2IN−) 7(2OUT)

## Notes on the sheets
sheet 3
- Temp & Humidity
- Temperature
- I2C
- Water Flow
- Water Level
- CO2
- EC
- PH
sheet 4
- Relay 0
- Relay 1
- Relay 2
- Relay 3
- Relay 4
- Relay 5
- Relay 6
- Relay 7
- Relay 8
- Relay 9
- Relay 10
sheet 5
- Mosfet 0
- Mosfet 1
- Mosfet 2
- Mosfet 3
- Mosfet 4
- Triac 0
- Triac 1
- Triac 2
- Triac 3
